# Altium schematic sheet Main.SchDoc
size A; SheetNumber: 1; SheetTotal: 1
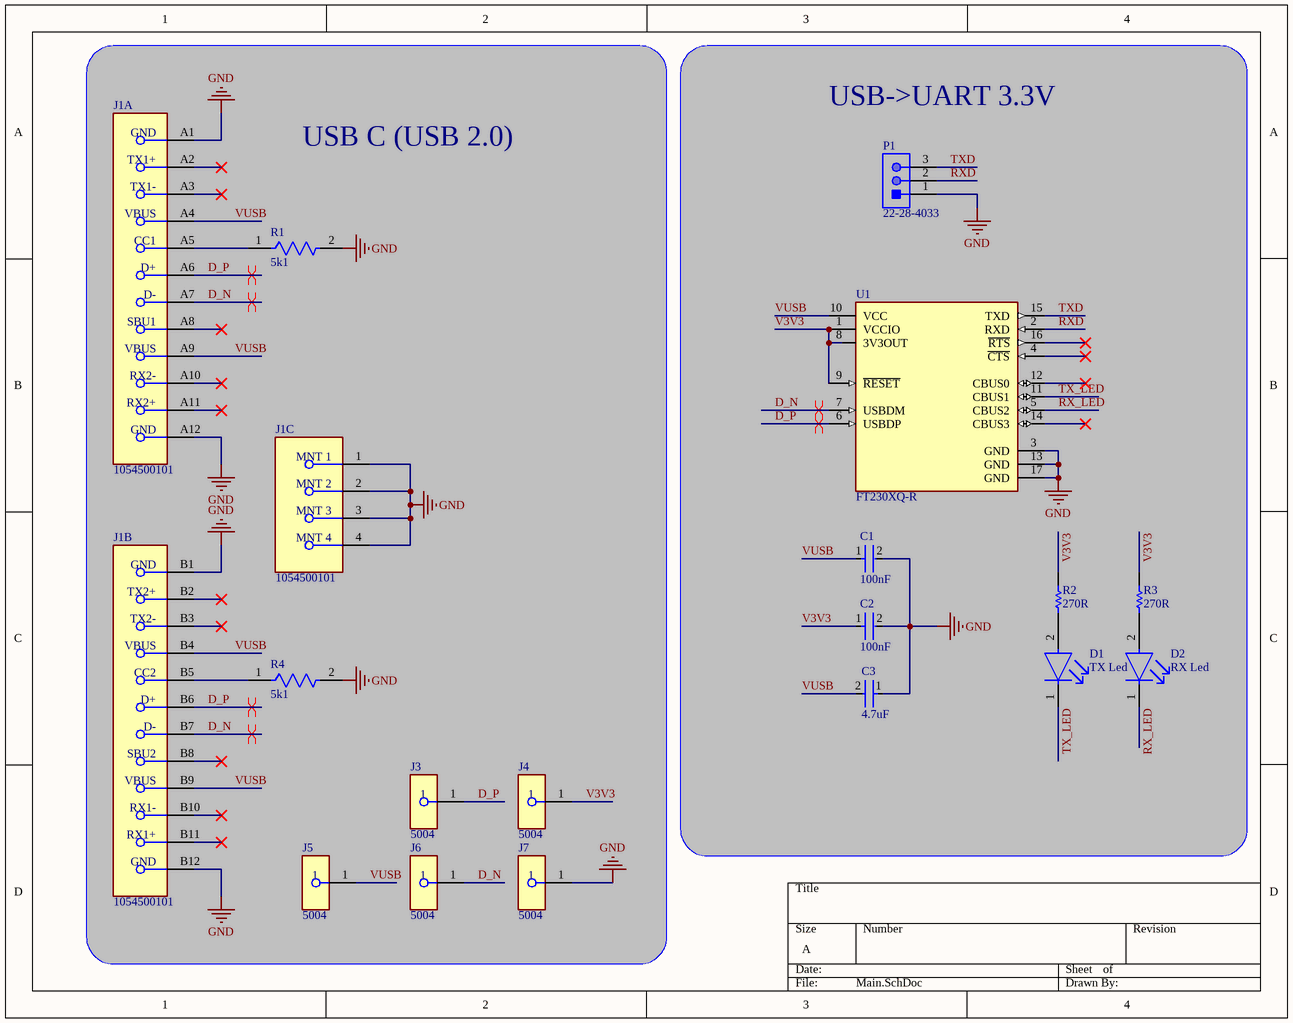
[diagram p0: Main.SchDoc]

## Parts
C1  100nF  [FP-CGA3E-0_3-0_1-IPC_A]
C2  100nF  [FP-CGA3E-0_3-0_1-IPC_A]
C3  4.7uF  [FP-GRM188-0_2-IPC_C]
D1  TX Led  [FP-LTST-C190GKT-MFG]
D2  RX Led  [FP-LTST-C190GKT-MFG]
J1  1054500101  [FP-1054500101-MFG]  (parts A,B,C of 3)
J3  5004  [FP-5004-MFG]
J4  5004  [FP-5004-MFG]
J5  5004  [FP-5004-MFG]
J6  5004  [FP-5004-MFG]
J7  5004  [FP-5004-MFG]
P1  22-28-4033  [MOLX-22-28-4033_V]
R1  5k1  [FP-CRCW0603-e3-IPC_C]
R2  270R  [RESC1608X55X30LL15T15]
R3  270R  [RESC1608X55X30LL15T15]
R4  5k1  [FP-CRCW0603-e3-IPC_C]
U1  FT230XQ-R  [FP-QFN-16-MFG]

## Blocks framed on the sheet
USB C (USB 2.0): J1 J3-J7 R1 R4
USB->UART 3.3V: C1-C3 D1 D2 P1 R2 R3 U1

## Nets
GND: C1.2 C2.2 C3.1 J1.1(MNT_1) J1.2(MNT_2) J1.3(MNT_3) J1.4(MNT_4) J1.A1(GND) J1.A12(GND) J1.B1(GND) J1.B12(GND) J7.1 P1.1 R1.2 R4.2 U1.3(GND) U1.13(GND) U1.17(GND)
D_N: J1.A7(D-) J1.B7(D-) J6.1 U1.7(USBDM)
D_P: J1.A6(D+) J1.B6(D+) J3.1 U1.6(USBDP)
RX_LED: D2.1(C) U1.5(CBUS2)
RXD: P1.2 U1.2(RXD)
TX_LED: D1.1(C) U1.11(CBUS1)
TXD: P1.3 U1.15(TXD)
V3V3: C2.1 J4.1 R2.2 R3.2 U1.1(VCCIO) U1.8(3V3OUT) U1.9(~{RESET})
VUSB: C1.1 C3.2 J1.A4(VBUS) J1.A9(VBUS) J1.B4(VBUS) J1.B9(VBUS) J5.1 U1.10(VCC)
NetD1_2: D1.2(A) R2.1
NetD2_2: D2.2(A) R3.1
NetJ1_A5: J1.A5(CC1) R1.1
NetJ1_B5: J1.B5(CC2) R4.1

Not connected (* = marked no-connect by the designer): J1 A2(TX1+)* A3(TX1-)* A8(SBU1)* A10(RX2-)* A11(RX2+)* B2(TX2+)* B3(TX2-)* B8(SBU2)* B10(RX1-)* B11(RX1+)*; U1 4(~{CTS})* 12(CBUS0)* 14(CBUS3)* 16(~{RTS})*

## Layout directives
differential pair: D_N, D_P

## Library data of the parts
C1 C2 = CMP-2000-07546-2: Cap Ceramic 100nF 50V X7R 10% Pad SMD 0603 +125°C Automotive T/R; Weight: 7.1E-05oz; Composition: Ceramic; Max Operating Temperature: 125°C; Termination: SMD/SMT; Dielectric: X7R; Length: 1.6mm; Package Quantity: 1; REACH SVHC: No SVHC; Lead Free: Lead Free; Case Code (Metric): 1608; Min Operating Temperature: -55°C; Packaging: Tape and Reel; Tolerance: 10%; Voltage Rating: 50V; Case Code (Imperial): 0603; Capacitance: 100nF; Case/Package: 0603; Voltage Rating (DC): 50V; Depth: 0.8mm; Radiation Hardening: No; Ratings: AEC-Q200; Mount: Surface Mount; Voltage: 50V; Thickness: 0.035inch; Width: 0.8mm; Height: 0.8mm
C3 = CMP-2006-02545-2: Chip Multilayer Ceramic Capacitors for General Purpose, 0603, 4.7uF, X5R, 15%, 10%, 35V; Lead Free: Lead Free; Max Operating Temperature: 85°C; Case Code (Imperial): 0603; Capacitance: 4.7uF; Width: 0.8mm; Thickness: 0.031inch; Case Code (Metric): 1608; Min Operating Temperature: -55°C; Voltage Rating (DC): 35V; Dielectric: X5R; Voltage: 35V; Packaging: Tape and Reel; Resistor Type: Ceramic; Weight: 0.000222oz; Mount: Surface Mount; Material: Ceramic; Depth: 0.8mm; Tolerance: 10%; REACH SVHC: No SVHC; Case/Package: 0603; Voltage Rating: 35V; Package Quantity: 4000; Height: 0.8mm; Length: 1.6mm; Termination: SMD/SMT
D1 D2 = CMP-22017-000005-2: LED GREEN CLEAR CHIP SMD; Dominant Wavelength: 569nm; Reverse Voltage: 5V; Lens Color: Colorless; Viewing Angle: 130°; Voltage: 2V; Forward Current: 30mA; Power Dissipation: 100mW; Luminous Intensity: 6mcd; Number of LEDs: 1; Forward Voltage: 2.1V; Wavelength: 565nm; Test Current: 10mA; Min Operating Temperature: -55°C; Lens Style: Clear; Mount: Surface Mount; Width: 0.8mm; Packaging: Tape and Reel; Lens Transparency: Clear; Case Code (Metric): 1608; Depth: 0.8mm; Case Code (Imperial): 0603; Case/Package: 0603; Number of Pins: 2; Max Operating Temperature: 85°C; Lead Free: Lead Free; Number of Elements: 1; Length: 1.6mm; Height: 0.8mm; Package Quantity: 1; Power Rating: 100mW; Radiation Hardening: No; Illumination Color: Green; Color: Green
J1 = CMP-04767-000004-1: CONN RCP USB3.1 TYPEC 24P SMD RA; Manufacturer: Molex; Number Of Contacts: 24; Description: USB Shielded I/O Receptacle; Type C; Right Angle; Surface Mount; Gold over Nickel; Voltage Rating: 30V; Shielding: true; Is Female: yes; Current Rating: 0.25/1.25/5A; Pitch: 0.5mm; Conn Orientation: Right Angle; Package: 0; Height: 3.44mm; Footprint Url: https://www.molex.com/pdm_docs/sd/1054500101_sd.pdf; Device Class L1: Connectors; Category: Conn; Device Class L2: USB Connectors; Digikey Description: CONN RCP USB3.1 TYPEC 24P SMD RA; Contact Material: Gold,Nickel; Mouser Description: USB Shielded I/O Receptacle; Type C; Right Angle; Surface Mount; Gold over Nickel; ComponentLink2Description: Datasheet; Lead Free: Yes; Automotive: No; Temperature Range High: +85°C; RoHS: TRUE; Octopart: https://octopart.com/105450-0101-molex-68082325; ComponentLink2URL: https://www.molex.com/webdocs/datasheets/pdf/en-us/1054500101_IO_CONNECTORS.pdf; Temperature: -30°C to +85°C; Usb Standard: USB 3.1; Temperature Range Low: -30°C; Device Class L3: unset; Manufacturer Part Number: 1054500101
J3-J7 = CMP-2000-05575-2: PC TEST POINT MINIATURE YELLOW; Manufacturer: Keystone; Number Of Contacts: 1; Is Female: yes; Device Class L1: Connectors; Manufacturer Part Number: 5004; Digikey Description: PC TEST POINT MINIATURE YELLOW; ComponentLink2URL: https://www.keyelco.com/product-pdf.cfm?p=1313; Lead Free: Yes; ComponentLink2Description: Datasheet; Category: Conn; Height: 4.72mm; Octopart: https://octopart.com/5004-keystone-28591; Mouser Description: TEST POINT PC MINI .040"D YELLOW; Device Class L3: unset; Contact Material: Silver; Package: 5004; Automotive: No; Device Class L2: unset; RoHS: TRUE
P1 = CMP-1676-00001-5: Male Header, Pitch 2.54 mm, 1 x 3 Position, Height 8.38 mm, Tail Length 3.18 mm, RoHS, Bulk; Manufacturer: Molex; Rows: 1; Voltage Rating: 250 V; Current Rating: 4 A; Min Operating Temperature: 0 degC; Lead Pitch: 0.1 inch; Packaging: Bulk; Contact Finish: Gold; RoHSCompliant: true; Contact Material: Brass; PackageReference: 22-28-4033; REACH SVHC: Unknown; PackageDescription: Male Header, Pitch 2.54 mm, 1 x 3 Position, Height 8.38 mm, Tail Length 3.18 mm; ComponentLink2URL: http://www.molex.com/pdm_docs/sd/022284033_sd.pdf; Height: 8.38 mm; Mounting Technology: Through Hole; ComponentLink1Description: Manufacturer URL; Length: 7.62 mm; Mount: Through Hole; DatasheetVersion: Rev. G, 01/2012; Max Operating Temperature: 75 degC; ComponentLink2Description: Datasheet; Colour: Black; Pins: 3; Contact Plating: Gold; Package Quantity: 1; ComponentLink1URL: http://www.molex.com/
R1 R4 = CMP-1012-00590-3: RES Thick Film, 5.1kΩ, 1%, 0.1W, 100ppm/°C, 0603; Power Rating: 100mW; Voltage Rating (DC): 75V; Resistance: 5.1kR; Width: 0.85mm; Depth: 0.85mm; Military Standard: Not; Package Quantity: 5000; Case Code (Metric): 1608; Length: 1.55mm; Weight: 7.1E-05oz; Packaging: Tape and Reel; Temperature Coefficient: 100ppm/°C; Case Code (Imperial): 0603; Lead Free: Lead Free; Radiation Hardening: No; Contact Plating: Tin; Composition: Thick Film; Max Operating Temperature: 155°C; Termination: SMD/SMT; Case/Package: 0603; Min Operating Temperature: -55°C; Tolerance: 1%; Voltage Rating: 75V; Mount: Surface Mount; Height: 0.45mm
R2 R3 = CMP-2000-00388-1: Manufacturer: Panasonic; Part Number: ERJ3EKF2700V
U1 = CMP-0248-00010-3: IC USB SERIAL BASIC UART 16QFN; Number of Channels: 1; Data Rate: 12Mbps; Operating Supply Current: 8mA; Max Supply Voltage: 5.5V; Operating Supply Voltage: 5V; Min Supply Voltage: 2.97V; Width: 4mm; Length: 4mm; Height: 0.75mm; Max Operating Temperature: 85°C; Interface: USB; Min Operating Temperature: -40°C; Package Quantity: 5000; Lead Free: Lead Free; Number of Pins: 16; Case/Package: QFN; Weight: 0.002014oz; Packaging: Tape and Reel; Mount: Surface Mount